# Altium schematic sheet BRK7010_sj.SchDoc: BRK6110
size C; Author: Jake Janovetz; Organization: Opal Kelly; Address1: 13500 SW 72nd Ave, STE 120; Address2: Portland, OR 97223; Address4: http://www.opalkelly.com; DocumentNumber: xxx; Revision: 1; SheetNumber: 1; SheetTotal: 1; PageSetup: Record=PageOptions|CenterHorizontal=True|CenterVertical=True|PrintScale=0.54|XCorrection=1.00|YCorrection=1.00|PrintKind=0|BorderSize=5000000|LeftOffset=0|BottomOffset=0|Orientation=2|PaperLength=1000|PaperWidth=1000|Scale=100|PaperSource=7|PrintQuality=-4|MediaType=1|DitherType=10|PaperKind=Letter|PrintScaleMode=1
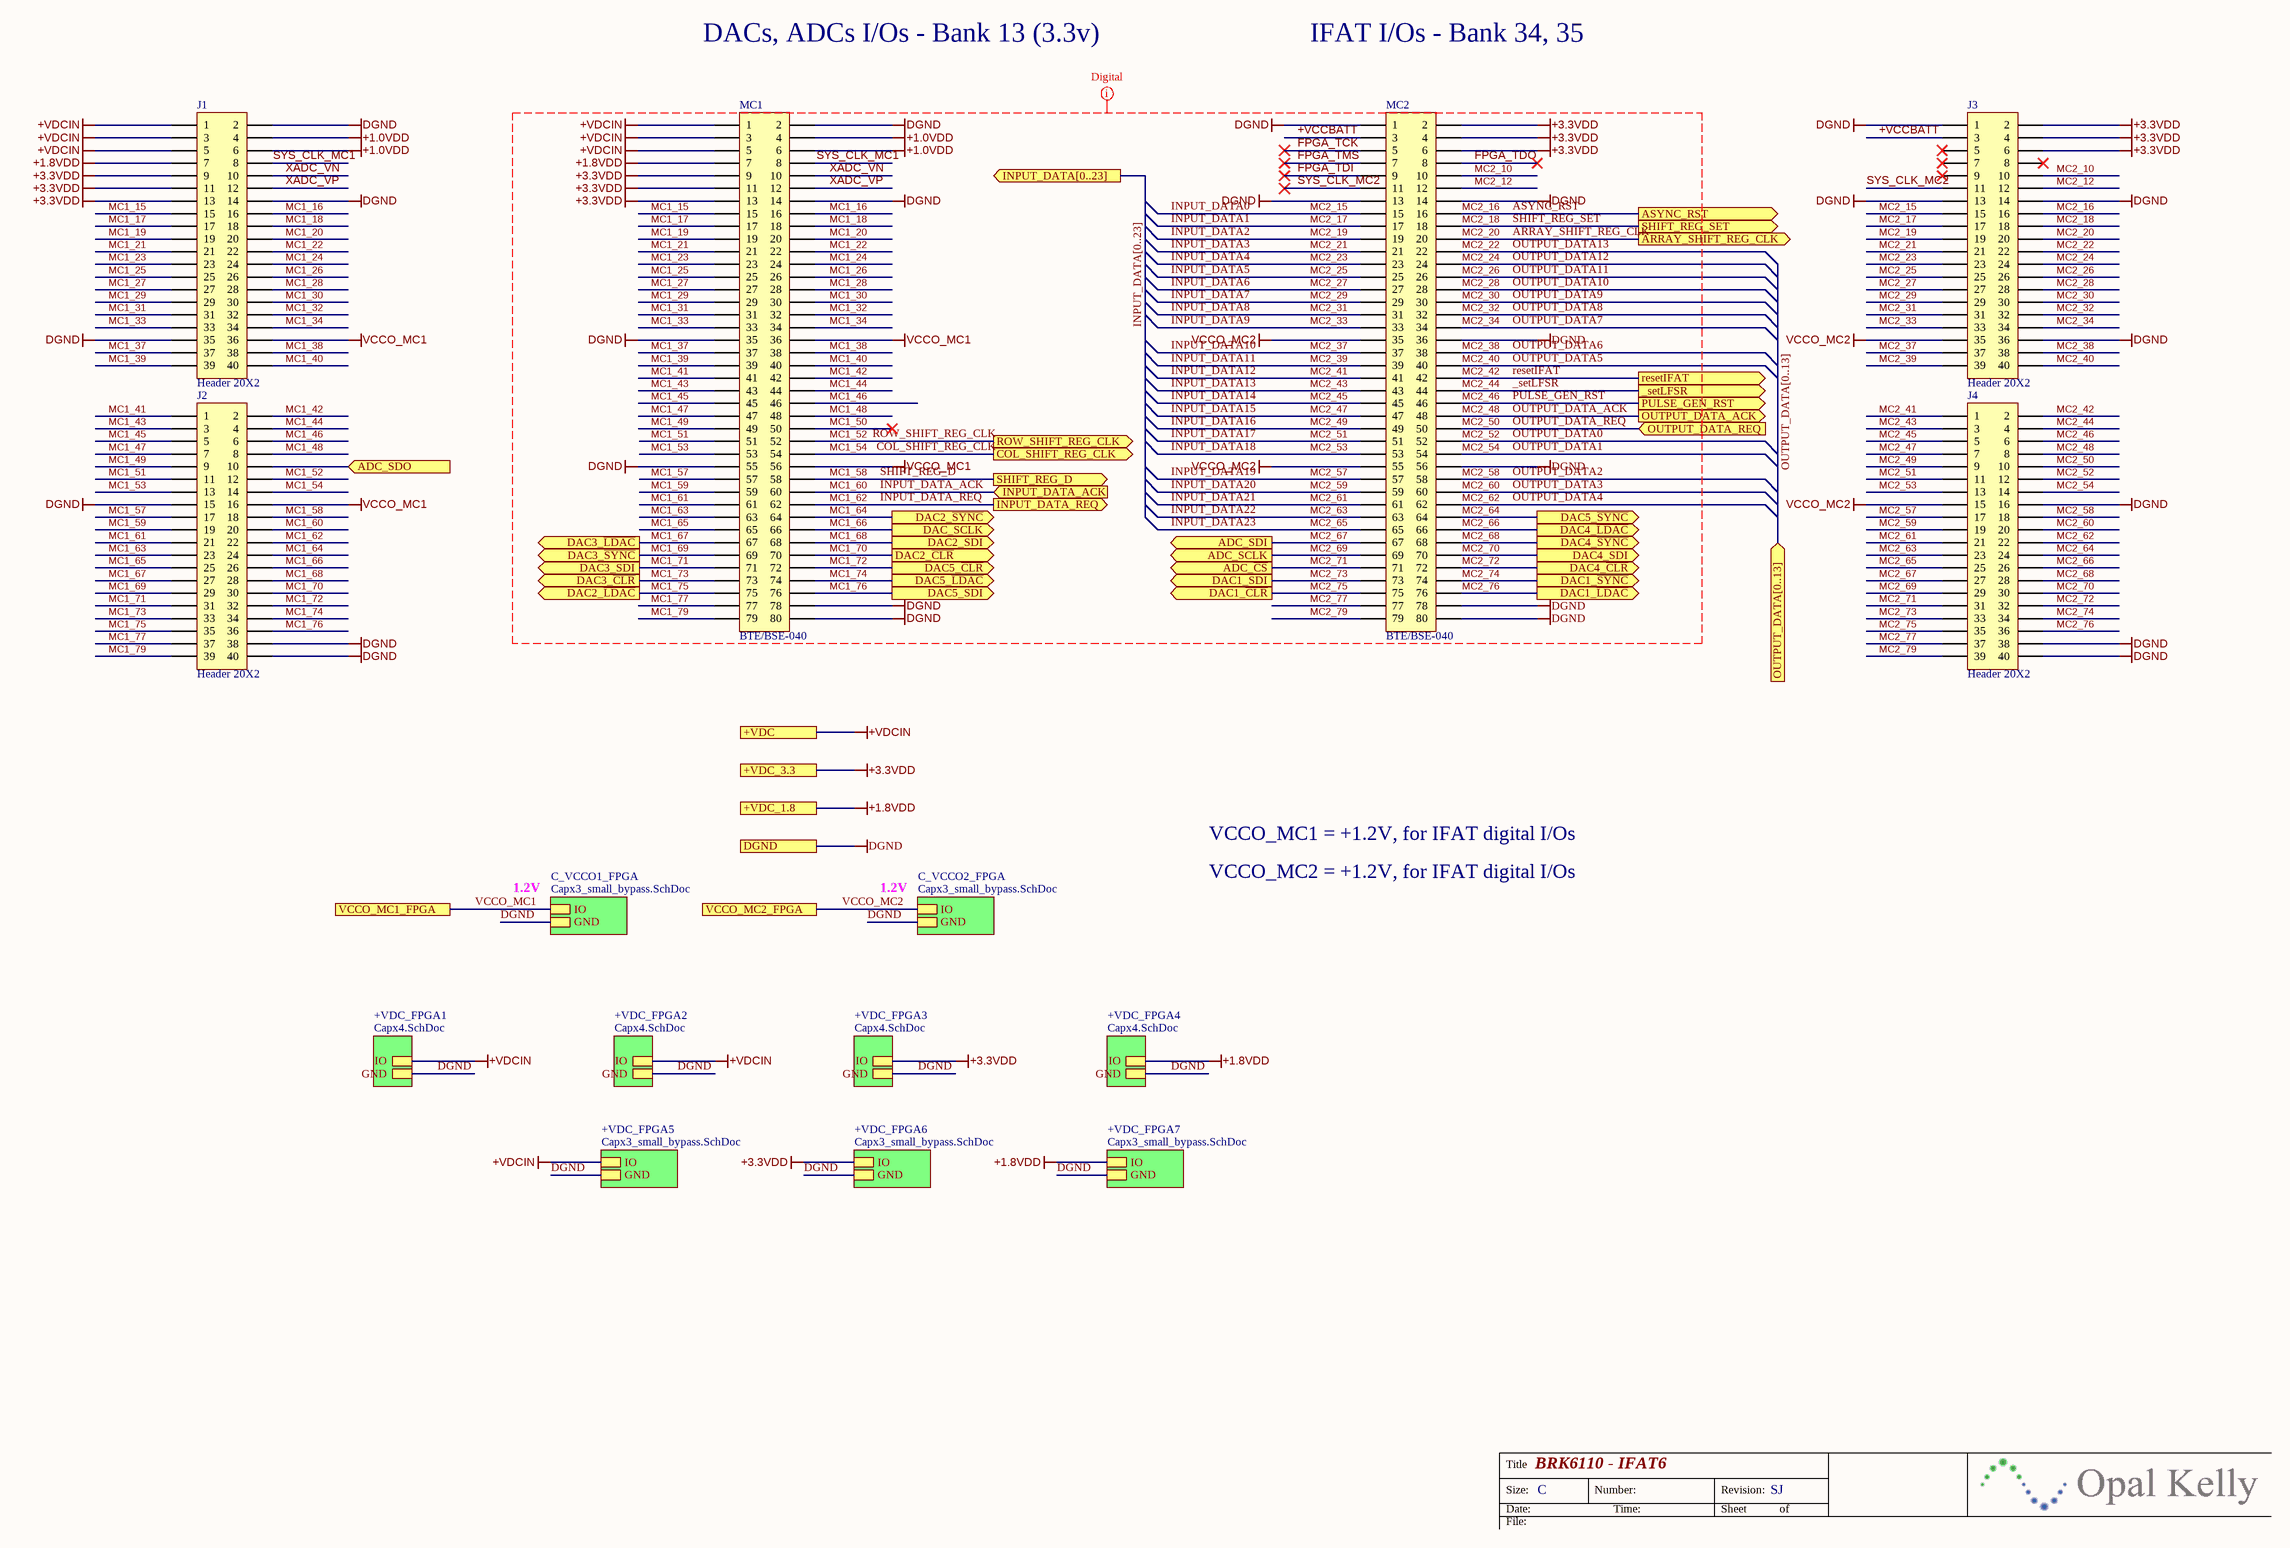
[diagram p0: BRK7010_sj.SchDoc]

## Parts
J1  Header 20X2  [Samtec TMMH-120-01-F-D]
J2  Header 20X2  [Samtec TMMH-120-01-F-D]
J3  Header 20X2  [Samtec TMMH-120-01-F-D]
J4  Header 20X2  [Samtec TMMH-120-01-F-D]
MC1  BTE/BSE-040  [Samtec BTE-040-01-L-D-A]
MC2  BTE/BSE-040  [Samtec BTE-040-01-L-D-A]

## Sub-sheets
+VDC_FPGA1 = Capx4.SchDoc: IO, GND
+VDC_FPGA2 = Capx4.SchDoc: IO, GND
+VDC_FPGA3 = Capx4.SchDoc: IO, GND
+VDC_FPGA4 = Capx4.SchDoc: IO, GND
+VDC_FPGA5 = Capx3_small_bypass.SchDoc: IO, GND
+VDC_FPGA6 = Capx3_small_bypass.SchDoc: IO, GND
+VDC_FPGA7 = Capx3_small_bypass.SchDoc: IO, GND
C_VCCO1_FPGA = Capx3_small_bypass.SchDoc: IO, GND
C_VCCO2_FPGA = Capx3_small_bypass.SchDoc: IO, GND

## Ports
+VDC, +VDC_1.8, +VDC_3.3, _setLFSR (out), ADC_SCLK (out), ADC_SDI (out), ADC_SDO (in), ADC_~{CS} (out), ARRAY_SHIFT_REG_CLK (out), ASYNC_RST (out), COL_SHIFT_REG_CLK (out), DAC1_SDI (out), DAC1_~{CLR} (out), DAC1_~{LDAC} (out), DAC1_~{SYNC} (out), DAC2_SDI (out), DAC2_~{CLR} (out), DAC2_~{LDAC} (out), DAC2_~{SYNC} (out), DAC3_SDI (out), DAC3_~{CLR} (out), DAC3_~{LDAC} (out), DAC3_~{SYNC} (out), DAC4_SDI (out), DAC4_~{CLR} (out), DAC4_~{LDAC} (out), DAC4_~{SYNC} (out), DAC5_SDI (out), DAC5_~{CLR} (out), DAC5_~{LDAC} (out), DAC5_~{SYNC} (out), DAC_SCLK (out), DGND, INPUT_DATA[0..23] (out), INPUT_DATA_ACK (in), INPUT_DATA_REQ (out), OUTPUT_DATA[0..13] (in), OUTPUT_DATA_ACK (out), OUTPUT_DATA_REQ (in), PULSE_GEN_RST (out), resetIFAT (out), ROW_SHIFT_REG_CLK (out), SHIFT_REG_D (out), SHIFT_REG_SET (out), VCCO_MC1_FPGA, VCCO_MC2_FPGA

## Nets
+1.0VDD: J1.4 J1.6 MC1.4 MC1.6
+1.8VDD: J1.7 MC1.7 ; port +VDC_1.8, sheet +VDC_FPGA4/IO, sheet +VDC_FPGA7/IO
+3.3VDD: J1.9 J1.11 J1.13 J3.2 J3.4 J3.6 MC1.9 MC1.11 MC1.13 MC2.2 MC2.4 MC2.6 ; port +VDC_3.3, sheet +VDC_FPGA3/IO, sheet +VDC_FPGA6/IO
+VDCIN: J1.1 J1.3 J1.5 MC1.1 MC1.3 MC1.5 ; port +VDC, sheet +VDC_FPGA1/IO, sheet +VDC_FPGA2/IO, sheet +VDC_FPGA5/IO
DGND: J1.2 J1.14 J1.35 J2.15 J2.38 J2.40 J3.1 J3.13 J3.14 J3.36 J4.16 J4.38 J4.40 MC1.2 MC1.14 MC1.35 MC1.55 MC1.78 MC1.80 MC2.1 MC2.13 MC2.14 MC2.36 MC2.56 MC2.78 MC2.80 ; port DGND, sheet +VDC_FPGA1/GND, sheet C_VCCO2_FPGA/GND, sheet +VDC_FPGA2/GND, sheet +VDC_FPGA3/GND, sheet +VDC_FPGA5/GND, sheet +VDC_FPGA6/GND, sheet +VDC_FPGA4/GND, sheet +VDC_FPGA7/GND, sheet C_VCCO1_FPGA/GND
VCCO_MC1: J1.36 J2.16 MC1.36 MC1.56 ; port VCCO_MC1_FPGA, sheet C_VCCO1_FPGA/IO
VCCO_MC2: J3.35 J4.15 MC2.35 MC2.55 ; port VCCO_MC2_FPGA, sheet C_VCCO2_FPGA/IO
+VCCBATT: J3.3 MC2.3
_setLFSR: J4.4 MC2.44 ; port _setLFSR  [also labelled MC2_44]
ADC_SDO: J2.10 ; port ADC_SDO
ARRAY_SHIFT_REG_CLK: J3.20 MC2.20 ; port ARRAY_SHIFT_REG_CLK  [also labelled MC2_20]
ASYNC_RST: J3.16 MC2.16 ; port ASYNC_RST  [also labelled MC2_16]
COL_SHIFT_REG_CLK: J2.14 MC1.54 ; port COL_SHIFT_REG_CLK  [also labelled MC1_54]
FPGA_TCK: MC2.5
FPGA_TDI: MC2.9
FPGA_TDO: MC2.8
FPGA_TMS: MC2.7
INPUT_DATA0: J3.15 MC2.15  [also labelled MC2_15]
INPUT_DATA1: J3.17 MC2.17  [also labelled MC2_17]
INPUT_DATA2: J3.19 MC2.19  [also labelled MC2_19]
INPUT_DATA3: J3.21 MC2.21  [also labelled MC2_21]
INPUT_DATA4: J3.23 MC2.23  [also labelled MC2_23]
INPUT_DATA5: J3.25 MC2.25  [also labelled MC2_25]
INPUT_DATA6: J3.27 MC2.27  [also labelled MC2_27]
INPUT_DATA7: J3.29 MC2.29  [also labelled MC2_29]
INPUT_DATA8: J3.31 MC2.31  [also labelled MC2_31]
INPUT_DATA9: J3.33 MC2.33  [also labelled MC2_33]
INPUT_DATA10: J3.37 MC2.37  [also labelled MC2_37]
INPUT_DATA11: J3.39 MC2.39  [also labelled MC2_39]
INPUT_DATA12: J4.1 MC2.41  [also labelled MC2_41]
INPUT_DATA13: J4.3 MC2.43  [also labelled MC2_43]
INPUT_DATA14: J4.5 MC2.45  [also labelled MC2_45]
INPUT_DATA15: J4.7 MC2.47  [also labelled MC2_47]
INPUT_DATA16: J4.9 MC2.49  [also labelled MC2_49]
INPUT_DATA17: J4.11 MC2.51  [also labelled MC2_51]
INPUT_DATA18: J4.13 MC2.53  [also labelled MC2_53]
INPUT_DATA19: J4.17 MC2.57  [also labelled MC2_57]
INPUT_DATA20: J4.19 MC2.59  [also labelled MC2_59]
INPUT_DATA21: J4.21 MC2.61  [also labelled MC2_61]
INPUT_DATA22: J4.23 MC2.63  [also labelled MC2_63]
INPUT_DATA23: J4.25 MC2.65  [also labelled MC2_65]
INPUT_DATA_ACK: J2.20 MC1.60 ; port INPUT_DATA_ACK  [also labelled MC1_60]
INPUT_DATA_REQ: J2.22 MC1.62 ; port INPUT_DATA_REQ  [also labelled MC1_62]
MC1_15: J1.15 MC1.15
MC1_16: J1.16 MC1.16
MC1_17: J1.17 MC1.17
MC1_18: J1.18 MC1.18
MC1_19: J1.19 MC1.19
MC1_20: J1.20 MC1.20
MC1_21: J1.21 MC1.21
MC1_22: J1.22 MC1.22
MC1_23: J1.23 MC1.23
MC1_24: J1.24 MC1.24
MC1_25: J1.25 MC1.25
MC1_26: J1.26 MC1.26
MC1_27: J1.27 MC1.27
MC1_28: J1.28 MC1.28
MC1_29: J1.29 MC1.29
MC1_30: J1.30 MC1.30
MC1_31: J1.31 MC1.31
MC1_32: J1.32 MC1.32
MC1_33: J1.33 MC1.33
MC1_34: J1.34 MC1.34
MC1_37: J1.37 MC1.37
MC1_38: J1.38 MC1.38
MC1_39: J1.39 MC1.39
MC1_40: J1.40 MC1.40
MC1_41: J2.1 MC1.41
MC1_42: J2.2 MC1.42
MC1_43: J2.3 MC1.43
MC1_44: J2.4 MC1.44
MC1_45: J2.5 MC1.45
MC1_46: J2.6 MC1.46
MC1_47: J2.7 MC1.47
MC1_48: J2.8 MC1.48
MC1_49: J2.9 MC1.49
MC1_50: MC1.50
MC1_51: J2.11 MC1.51
MC1_52: J2.12 MC1.52 ; port ROW_SHIFT_REG_CLK  [also labelled ROW_SHIFT_REG_CLK]
MC1_53: J2.13 MC1.53
MC1_57: J2.17 MC1.57
MC1_58: J2.18 MC1.58 ; port SHIFT_REG_D  [also labelled SHIFT_REG_D]
MC1_59: J2.19 MC1.59
MC1_61: J2.21 MC1.61
MC1_63: J2.23 MC1.63
MC1_64: J2.24 MC1.64 ; port DAC2_~{SYNC}
MC1_65: J2.25 MC1.65
MC1_66: J2.26 MC1.66 ; port DAC_SCLK
MC1_67: J2.27 MC1.67 ; port DAC3_~{LDAC}
MC1_68: J2.28 MC1.68 ; port DAC2_SDI
MC1_69: J2.29 MC1.69 ; port DAC3_~{SYNC}
MC1_70: J2.30 MC1.70 ; port DAC2_~{CLR}
MC1_71: J2.31 MC1.71 ; port DAC3_SDI
MC1_72: J2.32 MC1.72 ; port DAC5_~{CLR}
MC1_73: J2.33 MC1.73 ; port DAC3_~{CLR}
MC1_74: J2.34 MC1.74 ; port DAC5_~{LDAC}
MC1_75: J2.35 MC1.75 ; port DAC2_~{LDAC}
MC1_76: J2.36 MC1.76 ; port DAC5_SDI
MC1_77: J2.37 MC1.77
MC1_79: J2.39 MC1.79
MC2_10: J3.10 MC2.10
MC2_12: J3.12 MC2.12
MC2_18: J3.18 MC2.18 ; port SHIFT_REG_SET  [also labelled SHIFT_REG_SET]
MC2_22: J3.22 MC2.22  [also labelled OUTPUT_DATA13]
MC2_24: J3.24 MC2.24  [also labelled OUTPUT_DATA12]
MC2_26: J3.26 MC2.26  [also labelled OUTPUT_DATA11]
MC2_28: J3.28 MC2.28  [also labelled OUTPUT_DATA10]
MC2_30: J3.30 MC2.30  [also labelled OUTPUT_DATA9]
MC2_32: J3.32 MC2.32  [also labelled OUTPUT_DATA8]
MC2_34: J3.34 MC2.34  [also labelled OUTPUT_DATA7]
MC2_38: J3.38 MC2.38  [also labelled OUTPUT_DATA6]
MC2_40: J3.40 MC2.40  [also labelled OUTPUT_DATA5]
MC2_42: J4.2 MC2.42 ; port resetIFAT  [also labelled resetIFAT]
MC2_46: J4.6 MC2.46 ; port PULSE_GEN_RST  [also labelled PULSE_GEN_RST]
MC2_48: J4.8 MC2.48 ; port OUTPUT_DATA_ACK  [also labelled OUTPUT_DATA_ACK]
MC2_50: J4.10 MC2.50 ; port OUTPUT_DATA_REQ  [also labelled OUTPUT_DATA_REQ]
MC2_52: J4.12 MC2.52  [also labelled OUTPUT_DATA0]
MC2_54: J4.14 MC2.54  [also labelled OUTPUT_DATA1]
MC2_58: J4.18 MC2.58  [also labelled OUTPUT_DATA2]
MC2_60: J4.20 MC2.60  [also labelled OUTPUT_DATA3]
MC2_62: J4.22 MC2.62  [also labelled OUTPUT_DATA4]
MC2_64: J4.24 MC2.64 ; port DAC5_~{SYNC}
MC2_66: J4.26 MC2.66 ; port DAC4_~{LDAC}
MC2_67: J4.27 MC2.67 ; port ADC_SDI
MC2_68: J4.28 MC2.68 ; port DAC4_~{SYNC}
MC2_69: J4.29 MC2.69 ; port ADC_SCLK
MC2_70: J4.30 MC2.70 ; port DAC4_SDI
MC2_71: J4.31 MC2.71 ; port ADC_~{CS}
MC2_72: J4.32 MC2.72 ; port DAC4_~{CLR}
MC2_73: J4.33 MC2.73 ; port DAC1_SDI
MC2_74: J4.34 MC2.74 ; port DAC1_~{SYNC}
MC2_75: J4.35 MC2.75 ; port DAC1_~{CLR}
MC2_76: J4.36 MC2.76 ; port DAC1_~{LDAC}
MC2_77: J4.37 MC2.77
MC2_79: J4.39 MC2.79
SYS_CLK_MC1: J1.8 MC1.8
SYS_CLK_MC2: J3.11 MC2.11
XADC_VN: J1.10 MC1.10
XADC_VP: J1.12 MC1.12

Not connected (* = marked no-connect by the designer): J3 5* 7* 8* 9*

## Buses and harness runs
bus INPUT_DATA[0..23] = port INPUT_DATA[0..23]
bus OUTPUT_DATA[0..13] = port OUTPUT_DATA[0..13]

## Layout directives
net class Digital: +1.0VDD, +1.8VDD, +3.3VDD, +VCCBATT, +VDCIN, _setLFSR, ARRAY_SHIFT_REG_CLK, ASYNC_RST, COL_SHIFT_REG_CLK, DGND, FPGA_TCK, FPGA_TDI, FPGA_TDO, FPGA_TMS, INPUT_DATA0, INPUT_DATA1, INPUT_DATA2, INPUT_DATA3, INPUT_DATA4, INPUT_DATA5, INPUT_DATA6, INPUT_DATA7, INPUT_DATA8, INPUT_DATA9, INPUT_DATA10, INPUT_DATA11, INPUT_DATA12, INPUT_DATA13, INPUT_DATA14, INPUT_DATA15, INPUT_DATA16, INPUT_DATA17, INPUT_DATA18, INPUT_DATA19, INPUT_DATA20, INPUT_DATA21, INPUT_DATA22, INPUT_DATA23, INPUT_DATA[0..23], INPUT_DATA_ACK, INPUT_DATA_REQ, MC1_15, MC1_16, MC1_17, MC1_18, MC1_19, MC1_20, MC1_21, MC1_22, MC1_23, MC1_24, MC1_25, MC1_26, MC1_27, MC1_28, MC1_29, MC1_30, MC1_31, MC1_32, MC1_33, MC1_34, MC1_37, MC1_38, MC1_39, MC1_40, MC1_41, MC1_42, MC1_43, MC1_44, MC1_45, MC1_46, MC1_47, MC1_48, MC1_49, MC1_50, MC1_51, MC1_52, MC1_53, MC1_54, MC1_57, MC1_58, MC1_59, MC1_60, MC1_61, MC1_62, MC1_63, MC1_64, MC1_65, MC1_66, MC1_67, MC1_68, MC1_69, MC1_70, MC1_71, MC1_72, MC1_73, MC1_74, MC1_75, MC1_76, MC1_77, MC1_79, MC2_10, MC2_12, MC2_15, MC2_16, MC2_17, MC2_18, MC2_19, MC2_20, MC2_21, MC2_22, MC2_23, MC2_24, MC2_25, MC2_26, MC2_27, MC2_28, MC2_29, MC2_30, MC2_31, MC2_32, MC2_33, MC2_34, MC2_37, MC2_38, MC2_39, MC2_40, MC2_41, MC2_42, MC2_43, MC2_44, MC2_45, MC2_46, MC2_47, MC2_48, MC2_49, MC2_50, MC2_51, MC2_52, MC2_53, MC2_54, MC2_57, MC2_58, MC2_59, MC2_60, MC2_61, MC2_62, MC2_63, MC2_64, MC2_65, MC2_66, MC2_67, MC2_68, MC2_69, MC2_70, MC2_71, MC2_72, MC2_73, MC2_74, MC2_75, MC2_76, MC2_77, MC2_79, OUTPUT_DATA0, OUTPUT_DATA1, OUTPUT_DATA2, OUTPUT_DATA3, OUTPUT_DATA4, OUTPUT_DATA5, OUTPUT_DATA6, OUTPUT_DATA7, OUTPUT_DATA8, OUTPUT_DATA9, OUTPUT_DATA10, OUTPUT_DATA11, OUTPUT_DATA12, OUTPUT_DATA13, OUTPUT_DATA_ACK, OUTPUT_DATA_REQ, PULSE_GEN_RST, resetIFAT, ROW_SHIFT_REG_CLK, SHIFT_REG_D, SHIFT_REG_SET, SYS_CLK_MC1, SYS_CLK_MC2, VCCO_MC1, VCCO_MC2, XADC_VN, XADC_VP

## Notes on the sheet
- DACs, ADCs I/Os - Bank 13 (3.3v)
- IFAT I/Os - Bank 34, 35
- 1.2V
- VCCO_MC2 = +1.2V, for IFAT digital I/Os
- VCCO_MC1 = +1.2V, for IFAT digital I/Os
- Title
- Size:
- Date:
- File:
- BRK6110 - IFAT6
- C
- Number:
- Time:
- Revision:
- Sheet
- SJ
- of

## Library data of the parts
J1-J4 = Header 20X2: 2MM LOW PROFILE STRIPS / Connector Header position; Manufacturer: Generic Components; Revision: July-2002: Re-released for DXP Platform.; Publisher: Altium Limited; Class I: Connector; Supplier 1: Digi-Key; Supplier Part Number 1: TMMH-120-01-F-D-ND
MC1 MC2 = BTE/BSE-040: Board Stacking Connector, 80 Contact(s), 2 Row(s), Male, Straight, 0.031 inch Pitch, Surface Mount Terminal, Receptacle; Date: November 14, 2003; Supplier 1: Digi-Key; Supplier Part Number 1: SAM8745-ND